# Altium schematic sheet PMOD_ARD.SchDoc
size A3
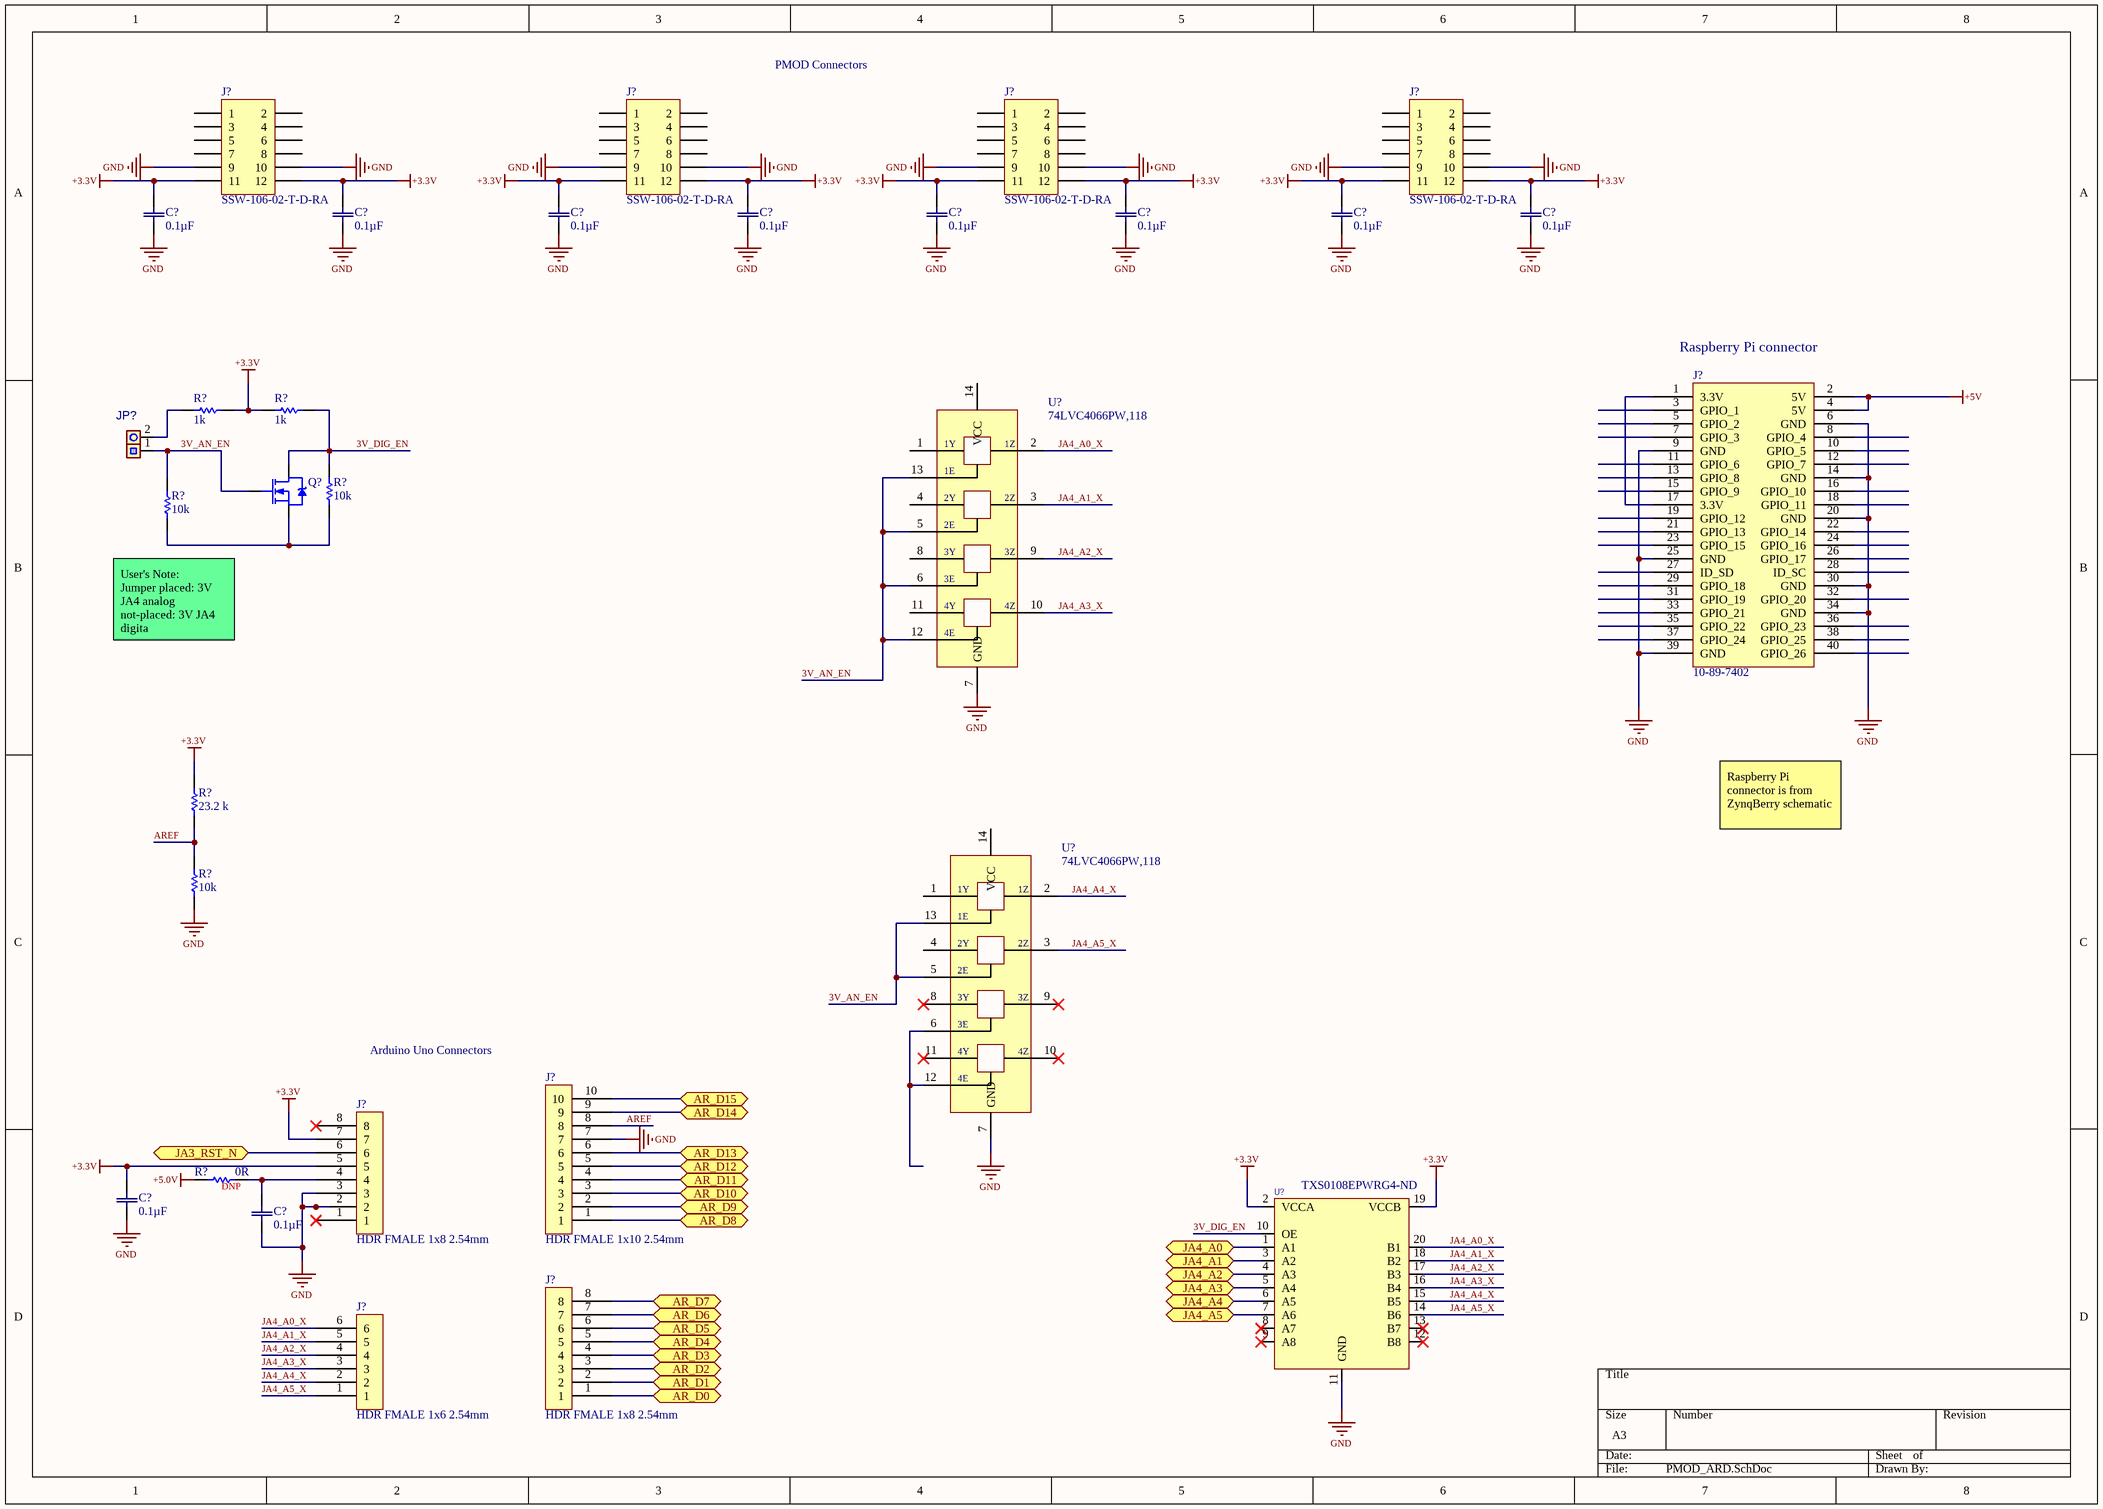
[diagram p0: PMOD_ARD.SchDoc]

## Parts
(Parts that share a designator on the sheet are numbered #1, #2 ... from top to bottom, then left to right.)
C?#1  0.1µF  [CAP_0603]
C?#2  0.1µF  [CAP_0603]
C?#3  0.1µF  [CAP_0603]
C?#4  0.1µF  [CAP_0603]
C?#5  0.1µF  [CAP_0603]
C?#6  0.1µF  [CAP_0603]
C?#7  0.1µF  [CAP_0603]
C?#8  0.1µF  [CAP_0603]
C?#9  0.1µF  [CAP_0603]
C?#10  0.1µF  [CAP_0603]
J?#1  SSW-106-02-T-D-RA  [HDR2X6H]
J?#2  SSW-106-02-T-D-RA  [HDR2X6H]
J?#3  SSW-106-02-T-D-RA  [HDR2X6H]
J?#4  SSW-106-02-T-D-RA  [HDR2X6H]
J?#5  10-89-7402  [HDR_M_2.54_2x40]
J?#6  HDR FMALE 1x10 2.54mm  [Hdr_Female_1x10_2.54mm]
J?#7  HDR FMALE 1x8 2.54mm  [Hdr_Female_1x8_2.54mm]
J?#8  HDR FMALE 1x8 2.54mm  [Hdr_Female_1x8_2.54mm]
J?#9  HDR FMALE 1x6 2.54mm  [Hdr_Female_1x6_2.54mm]
JP?  HDR-2.54 Male 1x2  [HDR_M_2.54_1x2]  (value not drawn)
Q?  BSS138-7-F  [DIODES_SOT23]  (value not drawn)
R?#1  value 1k  [RESC1005L_0402]  (hidden comment: RES0402_1K_0W1_1T)
R?#2  value 1k  [RESC1005L_0402]  (hidden comment: RES0402_1K_0W1_1T)
R?#3  value 10k  [RESC1005L_0402]  (hidden comment: RES0402_10K_0W1_05T)
R?#4  value 10k  [RESC1005L_0402]  (hidden comment: RES0402_10K_0W1_05T)
R?#5  23.2 k  [RESC1005L_0402]
R?#6  value 10k  [RESC1005L_0402]  (hidden comment: RES0402_10K_0W1_05T)
R?#7  value 0R  [RESC1005L_0402]  (hidden comment: RES0402_0R)
U?#1  74LVC4066PW,118
U?#2  74LVC4066PW,118
U?#3  Supplier Part Number: TXS0108EPWRG4-ND  [SOP65P640X120-20N]  (hidden comment: TXS0108EPWR)

## Ports
AR_D0 (bidir), AR_D1 (bidir), AR_D2 (bidir), AR_D3 (bidir), AR_D4 (bidir), AR_D5 (bidir), AR_D6 (bidir), AR_D7 (bidir), AR_D8 (bidir), AR_D9 (bidir), AR_D10 (bidir), AR_D11 (bidir), AR_D12 (bidir), AR_D13 (bidir), AR_D14 (bidir), AR_D15 (bidir), JA3_RST_N (bidir), JA4_A0 (bidir), JA4_A1 (bidir), JA4_A2 (bidir), JA4_A3 (bidir), JA4_A4 (bidir), JA4_A5 (bidir)

## Nets
+3.3V: C?#1.2 C?#2.2 C?#3.2 C?#4.2 C?#5.2 C?#6.2 C?#7.2 C?#8.2 C?#9.2 J?#1.11 J?#1.12 J?#2.11 J?#2.12 J?#3.11 J?#3.12 J?#4.11 J?#4.12 J?#7.5 J?#7.7 R?#1.1 R?#2.2 R?#5.2 U?#3.2(VCCA) U?#3.19(VCCB)
+5.0V: R?#7.1
+5V: J?#5.2(5V) J?#5.4(5V)
GND: C?#1.1 C?#2.1 C?#3.1 C?#4.1 C?#5.1 C?#6.1 C?#7.1 C?#8.1 C?#9.1 C?#10.1 J?#1.9 J?#1.10 J?#2.9 J?#2.10 J?#3.9 J?#3.10 J?#4.9 J?#4.10 J?#5.6(GND) J?#5.9(GND) J?#5.14(GND) J?#5.20(GND) J?#5.25(GND) J?#5.30(GND) J?#5.34(GND) J?#5.39(GND) J?#6.7 J?#7.2 J?#7.3 R?#6.1 U?#1.7(GND) U?#2.7(GND) U?#3.11(GND)
3V_AN_EN: JP?.1(P1) Q?.G R?#4.2 U?#1.5 U?#1.6 U?#1.12 U?#1.13 U?#2.5 U?#2.13
3V_DIG_EN: Q?.D R?#2.1 R?#3.2 U?#3.10(OE)
AR_D0: J?#8.1 ; port AR_D0
AR_D1: J?#8.2 ; port AR_D1
AR_D2: J?#8.3 ; port AR_D2
AR_D3: J?#8.4 ; port AR_D3
AR_D4: J?#8.5 ; port AR_D4
AR_D5: J?#8.6 ; port AR_D5
AR_D6: J?#8.7 ; port AR_D6
AR_D7: J?#8.8 ; port AR_D7
AR_D8: J?#6.1 ; port AR_D8
AR_D9: J?#6.2 ; port AR_D9
AR_D10: J?#6.3 ; port AR_D10
AR_D11: J?#6.4 ; port AR_D11
AR_D12: J?#6.5 ; port AR_D12
AR_D13: J?#6.6 ; port AR_D13
AR_D14: J?#6.9 ; port AR_D14
AR_D15: J?#6.10 ; port AR_D15
AREF: J?#6.8 R?#5.1 R?#6.2
JA3_RST_N: J?#7.6 ; port JA3_RST_N
JA4_A0: U?#3.1(A1) ; port JA4_A0
JA4_A0_X: J?#9.6 U?#1.2 U?#3.20(B1)
JA4_A1: U?#3.3(A2) ; port JA4_A1
JA4_A1_X: J?#9.5 U?#1.3 U?#3.18(B2)
JA4_A2: U?#3.4(A3) ; port JA4_A2
JA4_A2_X: J?#9.4 U?#1.9 U?#3.17(B3)
JA4_A3: U?#3.5(A4) ; port JA4_A3
JA4_A3_X: J?#9.3 U?#1.10 U?#3.16(B4)
JA4_A4: U?#3.6(A5) ; port JA4_A4
JA4_A4_X: J?#9.2 U?#2.2 U?#3.15(B5)
JA4_A5: U?#3.7(A6) ; port JA4_A5
JA4_A5_X: J?#9.1 U?#2.3 U?#3.14(B6)
NetC?#10_2: C?#10.2 J?#7.4 R?#7.2
NetJ?#5_1: J?#5.1(3.3V) J?#5.17(3.3V)
NetJP?_2: JP?.2(P2) R?#1.2
NetQ?_S: Q?.S R?#3.1 R?#4.1
NetU?#2_6: U?#2.6 U?#2.12

Not connected (* = marked no-connect by the designer): J?#1 1 2 3 4 5 6 7 8; J?#2 1 2 3 4 5 6 7 8; J?#3 1 2 3 4 5 6 7 8; J?#4 1 2 3 4 5 6 7 8; J?#5 3(GPIO_1) 5(GPIO_2) 7(GPIO_3) 8(GPIO_4) 10(GPIO_5) 11(GPIO_6) 12(GPIO_7) 13(GPIO_8) 15(GPIO_9) 16(GPIO_10) 18(GPIO_11) 19(GPIO_12) 21(GPIO_13) 22(GPIO_14) 23(GPIO_15) 24(GPIO_16) 26(GPIO_17) 27(ID_SD) 28(ID_SC) 29(GPIO_18) 31(GPIO_19) 32(GPIO_20) 33(GPIO_21) 35(GPIO_22) 36(GPIO_23) 37(GPIO_24) 38(GPIO_25) 40(GPIO_26); J?#7 1* 8*; U?#1 1 4 8 11 14(VCC); U?#2 1 4 8* 9* 10* 11* 14(VCC); U?#3 8(A7)* 9(A8)* 12(B8)* 13(B7)*

## Notes on the sheet
- PMOD Connectors
- (near J?#5) Raspberry Pi connector
- User's Note:
  Jumper placed: 3V JA4 analog
  not-placed: 3V JA4 digita
- Raspberry Pi connector is from ZynqBerry schematic
- Arduino Uno Connectors
- (near R?#7) DNP
- (in symbol 74LVC4066PW,118) 1Y; 1Z; 1E; 2Y; 2Z; 2E; 3Y; 3Z; 3E; 4Y; 4Z; 4E

## Library data of the parts
C?#1-C?#10 = CAP 0603X5R1E104K030BB: CAP CER 0.1UF 25V 10% X5R 0201; Manufacturer Part Number: C0603X5R1E104K030BB; Manufacturer: TDK Corporation; Detailed Description: 0.1µF ±10% 25V Ceramic Capacitor X5R 0201 (0603 Metric); Digi-Key Part Number: 445-13671-1-ND; Tolerance: ±10%; Voltage - Rated: 25V; Temperature Coefficient: X5R; Operating Temperature: -55°C ~ 85°C; Features: Low ESL; Applications: General Purpose; Mounting Type: Surface Mount, MLCC; Supplier 1: Digi-Key; Supplier Part Number 1: 445-13671-1-ND; Value: 0.1µF
J?#1-J?#4 = SSW-106-02-T-D-RA: CONN RCPT .100" 12PS DL R/A TIN; Manufacturer 1: Samtec Inc.; ComponentLink1Description: Datasheet; ComponentLink1URL: C:\Users\Public\Documents\Altium\AD16\Library\PDF\ssw-1xx-xx-xxx-x-xx-xxx-xx-mkt.pdf; Supplier 1: Digi-Key; Supplier Part Number 1: SAM10026-ND; Manufacturer Part Number 1: SSW-106-02-T-D-RA; Operating Temperature: -55°C ~ 105°C; Insulation Height: 0.195" (4.95mm)
J?#5 = Header 2x40: CONN HDR DUAL 40POS .100 SRT AU; Manufacturer: Molex, LLC; Manufacturer Part Number: 0010897402; Connector Type: Header, Breakaway; Pitch - Mating: 0.100" (2.54mm); Number of Positions: 40; Number of Positions Loaded: All; Style: Board to Board or Cable; Shrouding: Unshrouded; Contact Length - Mating: 0.240" (6.10mm); Contact Length - Post: 0.107" (2.71mm); Overall Contact Length: 0.437" (11.10mm); Material Flammability Rating: UL94 V-0; Supplier 1: Digi-Key; RoHS: RoHS Compliant; Category: Connectors, Interconnects; Stock 1: 386; Pricing 1: 1=6.7, 10=6.419, 25=5.8608, 50=5.5816, 100=5.3026, 250=4.74444, 500=4.46534 (USD); Packaging: Bulk; Part Status: Active; Contact Type: Male Pin; Number of Rows: 2; Row Spacing - Mating: 0.100" (2.54mm); Mounting Type: Through Hole; Termination: Solder; Fastening Type: Push-Pull; Insulation Height: 0.090" (2.29mm); Contact Shape: Square; Contact Finish - Mating: Gold; Contact Finish Thickness - Mating: 15µin (0.38µm); Contact Finish - Post: Tin; Contact Material: Copper Alloy; Insulation Material: Liquid Crystal Polymer (LCP), Glass Filled; Features: -; Operating Temperature: -; Ingress Protection: -; Insulation Color: Black; Current Rating: -; Voltage Rating: -; Mated Stacking Heights: -; Contact Finish Thickness - Post: 74.8µin (1.90µm); Applications: Automotive, General Purpose, Lighting, Medical, Telecommunications; ComponentLink1URL: http://www.molex.com/pdm_docs/sd/010897041_sd.pdf; ComponentLink1Description: http://www.molex.com/pdm_docs/sd/010897041_sd.pdf; Supplier Part Number 1: WM50012-40-ND
J?#6 = M20-7821046: 10-WAY SIL VERT SOCKET L/FREE; Manufacturer 1: Harwin Inc; Connector Type: Receptacle; Number of Positions: 10; Number of Positions Loaded: All; Pitch: 0.100" (2.54mm); .Creator: MM; .Checked PCB: RF; Supplier 1: Digi-Key; Manufacturer Part Number 1: M20-7821046; RoHS: RoHS Compliant; Category: Connectors, Interconnects; Stock 1: 214; Pricing 1: 1=1.28, 23=1.12217, 46=1.05609, 69=1.01203, 115=0.968, 253=0.88, 506=0.792, 1012=0.704, 2507=0.638 (USD); Packaging: Tube; Contact Type: Female Socket; Number of Rows: 1; Row Spacing: -; Mounting Type: Through Hole; Termination: Solder; Fastening Type: -; Features: -; Contact Finish: Tin; Contact Finish Thickness: -; Color: Black; ComponentLink1URL: http://harwin.com/includes/pdfs/M20-782.pdf; ComponentLink1Description: http://harwin.com/includes/pdfs/M20-782.pdf; Supplier Part Number 1: 952-1847-ND; .Checked SCH: RF
J?#7 J?#8 = M20-7820842: 08-WAY SIL VERT SOCKET L/FREE; Manufacturer 1: Harwin Inc; Connector Type: Receptacle; Number of Positions: 8; Number of Positions Loaded: All; Pitch: 0.100" (2.54mm); .Creator: MM; .Checked PCB: RF; Supplier 1: Digi-Key; Manufacturer Part Number 1: M20-7820842; RoHS: RoHS Compliant; Category: Connectors, Interconnects; Stock 1: 2070; Pricing 1: 1=1.1, 29=0.91207, 58=0.87397, 116=0.83603, 261=0.76, 522=0.684, 1015=0.608, 2523=0.551 (USD); Packaging: Tube; Contact Type: Female Socket; Number of Rows: 1; Row Spacing: -; Mounting Type: Through Hole; Termination: Solder; Fastening Type: -; Features: -; Contact Finish: Gold; Contact Finish Thickness: Flash; Color: Black; ComponentLink1URL: http://harwin.com/includes/pdfs/M20-782.pdf; ComponentLink1Description: http://harwin.com/includes/pdfs/M20-782.pdf; Supplier Part Number 1: 952-1823-ND; .Checked SCH: RF
J?#9 = M20-7820646: 06-WAY SIL VERT SOCKET L/FREE; Manufacturer 1: Harwin Inc; Connector Type: Receptacle; Number of Positions: 6; Number of Positions Loaded: All; Pitch: 0.100" (2.54mm); .Checked PCB: MM; Supplier 1: Digi-Key; Manufacturer Part Number 1: M20-7820646; RoHS: RoHS Compliant; Category: Connectors, Interconnects; Stock 1: 87; Pricing 1: 1=0.96, 38=0.79211, 76=0.75895, 114=0.72596, 266=0.66, 532=0.594, 1026=0.528, 2508=0.4785 (USD); Packaging: Tube; Contact Type: Female Socket; Number of Rows: 1; Row Spacing: -; Mounting Type: Through Hole; Termination: Solder; Fastening Type: -; Features: -; Contact Finish: Tin; Contact Finish Thickness: -; Color: Black; ComponentLink1URL: http://harwin.com/includes/pdfs/M20-782.pdf; ComponentLink1Description: http://harwin.com/includes/pdfs/M20-782.pdf; Supplier Part Number 1: 952-1809-ND; .Checked SCH: MM; .Creator: MM
JP? = Header 1x2: CONN HEADER 2POS .100" SGL GOLD; Manufacturer Part Number 1: TSW-102-07-G-S; Manufacturer 1: Samtec; Part Checked: Jennifer Hancock; Description_: CON HDR-2.54 MALE 1x2 GOLD 5.84MH TH VERT; Populated: Yes; Package: Through Hole; Supplier 1: Digi-Key; Supplier Part Number 1: SAM1029-02-ND; Value: HDR-2.54 Male 1x2; Part Footprint Checked: *; Part Golden: Jennifer Hancock; Part 3D Model Checked: Jennifer Hancock; Manufacturer 2: FCI; Manufacturer Part Number 2: 68000-236HLF; Revision Date: 08/14/2015; Tolerance: *; Rating: *; Owner: *; Document Link: //depot_np_hweng_boards/altium_libraries/datasheets/Samtec/TSW_TH.pdf
Q? = BSS138-7-F: MOSFET N-CH 50V 200MA SOT23-3; Manufacturer 1: Diodes Incorporated; ComponentLink1Description: Datasheet; ComponentLink1URL: C:\Users\Public\Documents\Altium\AD16\Library\PDF\ds30144.pdf; Supplier 1: Digi-Key; Supplier Part Number 1: BSS138-FDICT-ND; Manufacturer Part Number 1: BSS138-7-F; Operating Temperature: -55°C ~ 150°C (TJ)
R?#1 R?#2 = RES0402_1K_0W1_1T: RES SMD 1K OHM 1% 1/10W 0402; Manufacturer 1: Panasonic Electronic Components; Manufacturer Part Number 1: ERJ-2RKF1001X; Package: 0402; ComponentLink1Description: Datasheet; Power: 1/10W; Tolerance: 1%; Supplier 1: Digi-Key; Supplier Part Number 1: P1.00KLCT-ND
R?#3 R?#4 R?#6 = RES0402_10K_0W1_05T: RES SMD 10K OHM 0.5% 1/16W 0402; Manufacturer: Panasonic Electronic Components; Manufacturer Part Number: ERJ-2RHD1002X; Package: 0402; ComponentLink1Description: Datasheet; Power: 1/16W; Tolerance: 0.5%; Supplier 1: Digi-Key; Supplier Part Number 1: P15984CT-ND
R?#5 = RES0402_23K2: RES 23.2K OHM 0402 0.1% 1/16W; Manufacturer: Vishay Dale; Manufacturer Part Number: TNPW040223K2BEED; Power (Watts): 0.1W, 1/10W; Temperature Coefficient: ±25ppm/°C; Supplier 1: Digi-Key; RoHS: RoHS Compliant; Category: Resistors; Stock 1: 25282; Pricing 1: 1=0.65, 10=0.462, 100=0.2402, 1000=0.12936, 2500=0.1276 (USD); Packaging: Cut Tape (CT); Part Status: Active; Tolerance: ±0.1%; Composition: Thin Film; Features: Anti-Sulfur, Automotive AEC-Q200, Moisture Resistant; Operating Temperature: -55°C ~ 155°C; Package / Case: 0402 (1005 Metric); Supplier Device Package: 0402; Size / Dimension: 0.039" L x 0.020" W (1.00mm x 0.50mm); Height - Seated (Max): 0.016" (0.40mm); Failure Rate: -; ComponentLink1URL: http://www.vishay.com/docs/28758/tnpw_e3.pdf; ComponentLink1Description: http://www.vishay.com/docs/28758/tnpw_e3.pdf; Supplier Part Number 1: TNP23.2KDACT-ND; Value: 23.2 k
R?#7 = RES0402_0R: RES SMD 0 OHM JUMPER 1/16W 0402; Manufacturer 1: Vishay Dale; Manufacturer Part Number 1: CRCW04020000Z0ED; Power: 0.063W, 1/16W; Package: 0402; ComponentLink1Description: Datasheet; Tolerance: -; Supplier 1: Digi-Key; Supplier Part Number 1: 541-0.0JCT-ND
U?#1 U?#2 = 74LVC4066PW,118: IC SWITCH QUAD SPST 14TSSOP; Manufacturer: Nexperia USA Inc.; Switch Circuit: SPST - NO; Multiplexer/Demultiplexer Circuit: 1:1; On-State Resistance (Max): 10 Ohm; Voltage - Supply, Single (V+): 1.65 V ~ 5.5 V; Switch Time (Ton, Toff) (Max): 3.9ns, 5ns; -3db Bandwidth: 500MHz; Charge Injection: 7.5pC; Channel Capacitance (CS(off), CD(off)): 8pF; Current - Leakage (IS(off)) (Max): 5µA; Crosstalk: -56dB @ 1MHz; Supplier 1: Digi-Key; Manufacturer Part Number: 74LVC4066PW,118; RoHS: RoHS Compliant; Category: Integrated Circuits (ICs); Stock 1: 12914; Pricing 1: 1=0.78, 10=0.687, 100=0.5266, 500=0.41632, 1000=0.33306 (USD); Packaging: Cut Tape (CT); Part Status: Active; Channel-to-Channel Matching (&Delta;Ron): -; Voltage - Supply, Dual (V±): -; Operating Temperature: -40°C ~ 125°C (TA); Package / Case: 14-TSSOP (0.173", 4.40mm Width); Supplier Device Package: 14-TSSOP; ComponentLink1URL: http://assets.nexperia.com/documents/data-sheet/74LVC4066.pdf; ComponentLink1Description: http://assets.nexperia.com/documents/data-sheet/74LVC4066.pdf; Supplier Part Number 1: 1727-7306-1-ND
U?#3 = TXS0108EPWR: IC 8BIT NON-INV TRANSLTR 20TSSOP; Manufacturer Part Number: TXS0108EPWRG4; Manufacturer: Texas Instruments; Voltage - VCCA: 1.2 V ~ 3.6 V; Channels per Circuit: 8; Output Type: Open Drain, Push-Pull; Channel Type: Bidirectional; Data Rate: 60Mbps; Voltage - VCCB: 1.65 V ~ 5.5 V; Number of Circuits: 1; Translator Type: Voltage Level; Features: Auto-Direction Sensing; Mounting Type: Surface Mount; Output Signal: -; RoHS: RoHS Compliant; Input Signal: -; Packaging: Tape & Reel (TR); Operating Temperature: -40°C ~ 85°C (TA); Supplier: Digi-Key; Category: Integrated Circuits (ICs); Package / Case: 20-TSSOP (0.173", 4.40mm Width); Supplier Device Package: 20-TSSOP